# Altium schematic sheet CarACESP32.SchDoc
size A4; SheetNumber: 1; SheetTotal: 2
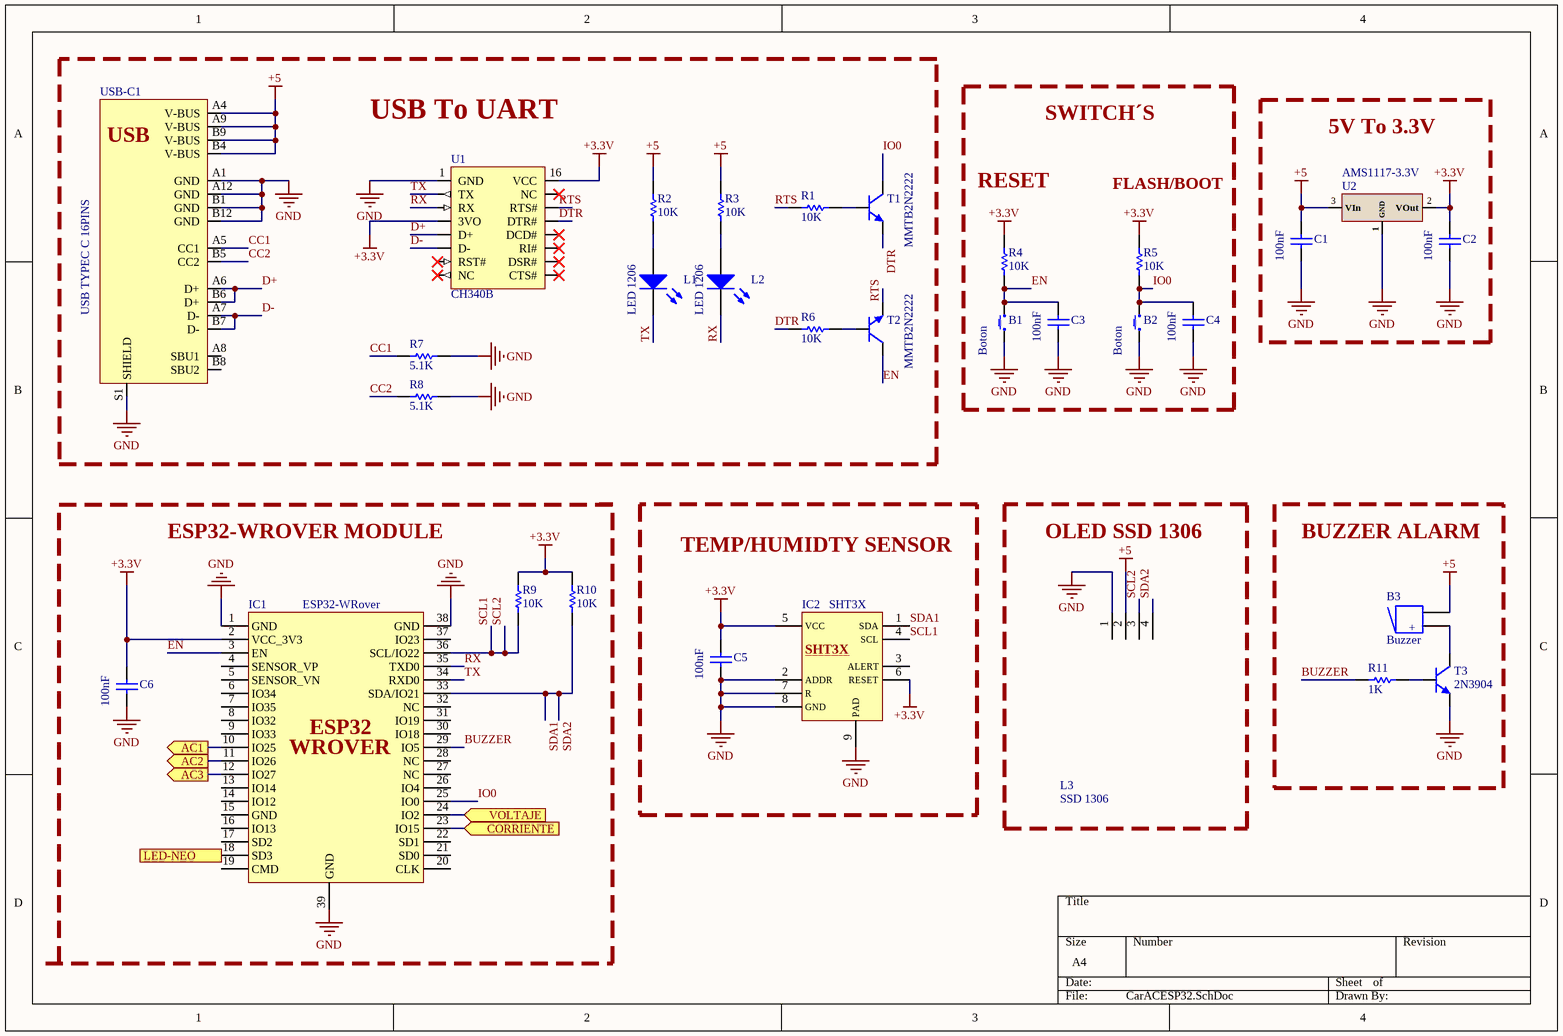
[diagram p0: CarACESP32.SchDoc]

## Parts
B1  Boton  [Push Boton 2P C]
B2  Boton  [Push Boton 2P C]
B3  Buzzer  [Buzzer]
C1  100nF  [Capacitor 1206]
C2  100nF  [Capacitor 1206]
C3  100nF  [Capacitor 1206]
C4  100nF  [Capacitor 1206]
C5  100nF  [Capacitor 1206]
C6  100nF  [Capacitor 1206]
IC1  ESP32-WRover  [ESP32-WROVER-B]
IC2  SHT3X  [DFN-8_DD]
L1  LED 1206  [LED 1206 G]
L2  LED 1206  [LED 1206 R]
L3  SSD 1306  [OLEDSSD1306]
R1  10K  [Resistencia 1206]
R2  10K  [Resistencia 1206]
R3  10K  [Resistencia 1206]
R4  10K  [Resistencia 1206]
R5  10K  [Resistencia 1206]
R6  10K  [Resistencia 1206]
R7  5.1K  [Resistencia 1206]
R8  5.1K  [Resistencia 1206]
R9  10K  [Resistencia 1206]
R10  10K  [Resistencia 1206]
R11  1K  [Resistencia 1206]
T1  MMTB2N2222  [SOT23_M]
T2  MMTB2N2222  [SOT23_M]
T3  2N3904  [NewTO-92A]
U1  CH340B  [SOIC 16]
U2  AMS1117-3.3V  [SOT 223]
USB-C1  USB TYPEC C 16PINS  [USB-TYPE_C-16]

## Blocks framed on the sheet
USB To UART: L1 L2 R1-R3 R6-R8 T1 T2 U1 USB-C1
5V To 3.3V: C1 C2 U2
TEMP/HUMIDTY SENSOR: C5 IC2
OLED SSD 1306: L3
BUZZER ALARM: B3 R11 T3

## Ports
AC1 (out), AC2 (out), AC3 (out), CORRIENTE (in), LED-NEO (out), VOLTAJE (in)

## Nets
+3.3V: C2.2 C5.2 C6.2 IC1.2(VCC_3V3) IC2.5(VCC) IC2.6(RESET) R4.2(B) R5.2(B) R9.2(B) R10.2(B) U1.4(3VO) U1.16(VCC) U2.2(VOut)
+5: B3.2 C1.2 L3.2 R2.2(B) R3.2(B) U2.3(VIn) USB-C1.A4(V-BUS) USB-C1.A9(V-BUS) USB-C1.B4(V-BUS) USB-C1.B9(V-BUS)
GND: B1.1 B2.1 C1.1 C2.1 C3.1 C4.1 C5.1 C6.1 IC1.1(GND) IC1.38(GND) IC1.39(GND) IC2.2(ADDR) IC2.7(R) IC2.8(GND) IC2.9(PAD) L3.1 R7.1(A) R8.1(A) T3.1(E) U1.1(GND) U2.1(GND) USB-C1.A1(GND) USB-C1.A12(GND) USB-C1.B1(GND) USB-C1.B12(GND) USB-C1.S1(SHIELD)
AC1: IC1.10(IO25) ; port AC1
AC2: IC1.11(IO26) ; port AC2
AC3: IC1.12(IO27) ; port AC3
BUZZER: IC1.29(IO5) R11.2(B)
CC1: R7.2(B) USB-C1.A5(CC1)
CC2: R8.2(B) USB-C1.B5(CC2)
CORRIENTE: IC1.23(IO15) ; port CORRIENTE
D+: U1.5(D+) USB-C1.A6(D+) USB-C1.B6(D+)
D-: U1.6(D-) USB-C1.A7(D-) USB-C1.B7(D-)
DTR: R6.2(B) T1.2(E) U1.13(DTR#)
EN: B1.2 C3.2 IC1.3(EN) R4.1(A) T2.3(C)
IO0: B2.2 C4.2 IC1.25(IO0) R5.1(A) T1.3(C)
LED-NEO: IC1.18(SD3) ; port LED-NEO
RTS: R1.2(B) T2.2(E) U1.14(RTS#)
RX: IC1.35(TXD0) L2.2(K) U1.3(RX)
SCL1: IC1.36(SCL/IO22) IC2.4(SCL) L3.3 R9.1(A)  [also labelled SCL2]
SDA1: IC1.33(SDA/IO21) IC2.1(SDA) L3.4 R10.1(A)  [also labelled SDA2]
TX: IC1.34(RXD0) L1.2(K) U1.2(TX)
VOLTAJE: IC1.24(IO2) ; port VOLTAJE
NetB3_1: B3.1 T3.3(C)
NetL1_1: L1.1(A) R2.1(A)
NetL2_1: L2.1(A) R3.1(A)
NetR1_1: R1.1(A) T1.1(B)
NetR6_1: R6.1(A) T2.1(B)
NetR11_1: R11.1(A) T3.2(B)

Not connected (* = marked no-connect by the designer): IC1 4(SENSOR_VP) 5(SENSOR_VN) 6(IO34) 7(IO35) 8(IO32) 9(IO33) 13(IO14) 14(IO12) 15(GND) 16(IO13) 17(SD2) 19(CMD) 20(CLK) 21(SD0) 22(SD1) 26(IO4) 27(NC) 28(NC) 30(IO18) 31(IO19) 32(NC) 37(IO23); IC2 3(ALERT); U1 7(RST#)* 8(NC)* 9(CTS#)* 10(DSR#)* 11(RI#)* 12(DCD#)* 15(NC)*; USB-C1 A8(SBU1) B8(SBU2)

## Notes on the sheet
- SWITCH´S
- RESET
- FLASH/BOOT
- ESP32-WROVER MODULE
- (in symbol Buzzer) +
- (in symbol ESP32-WRover) ESP32; WROVER
- (in symbol USB TYPEC C 16PINS) USB

## Library data of the parts
B1 B2 = Push Boton 2 Pin TH: Micro Push TH
B3 = Buzzer: Active Sound
C1-C6 = Capacitor 1206: Capacitor cerámico 1206 SMD
IC1 = ESP32-WRover: ESP32-WRover 39Pins
L1 L2 = LED 1206: LED SMD 1206
L3 = SSD 1306: Pantalla OLED 124x64
R1-R11 = Resistencia SMD 1206
T1 T2 = MMBT2N2222A
U1 = CH340B: USB-Serial Converter
U2 = AMS1117: Regulador Lineal de Voltaje
USB-C1 = USB TYPEC C 16PINS: USB Type C 16 Pins